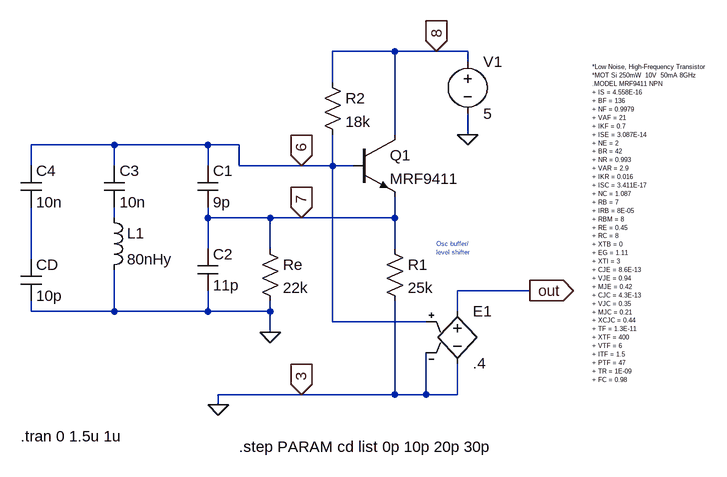
[diagram p0: schematic Collpits_basico.asc]
Collpits_basico.asc, the LTspice schematic file:
Version 4
SHEET 1 1440 1008
WIRE 944 144 848 144
WIRE 1008 144 944 144
WIRE 1056 144 1008 144
WIRE 1056 160 1056 144
WIRE 848 192 848 144
WIRE 944 272 944 144
WIRE 1056 272 1056 240
WIRE 512 288 384 288
WIRE 656 288 512 288
WIRE 704 288 656 288
WIRE 384 320 384 288
WIRE 512 320 512 288
WIRE 656 320 656 288
WIRE 704 320 704 288
WIRE 800 320 704 320
WIRE 848 320 848 272
WIRE 848 320 800 320
WIRE 880 320 848 320
WIRE 512 400 512 384
WIRE 656 400 656 384
WIRE 752 400 656 400
WIRE 800 400 752 400
WIRE 944 400 944 368
WIRE 944 400 800 400
WIRE 656 448 656 400
WIRE 752 448 752 400
WIRE 944 448 944 400
WIRE 384 464 384 384
WIRE 1152 512 1040 512
WIRE 384 544 384 528
WIRE 512 544 512 480
WIRE 512 544 384 544
WIRE 656 544 656 512
WIRE 656 544 512 544
WIRE 752 544 752 528
WIRE 752 544 656 544
WIRE 1040 544 1040 512
WIRE 848 560 848 320
WIRE 992 560 848 560
WIRE 752 576 752 544
WIRE 800 672 672 672
WIRE 944 672 944 528
WIRE 944 672 800 672
WIRE 992 672 992 608
WIRE 992 672 944 672
WIRE 1040 672 1040 624
WIRE 1040 672 992 672
WIRE 672 688 672 672
FLAG 800 320 6
IOPIN 800 320 In
FLAG 800 400 7
IOPIN 800 400 In
FLAG 1056 272 0
FLAG 752 576 0
FLAG 1152 512 out
IOPIN 1152 512 Out
FLAG 800 672 3
IOPIN 800 672 In
FLAG 672 688 0
FLAG 1008 144 8
IOPIN 1008 144 In
SYMBOL cap 640 320 R0
SYMATTR InstName C1
SYMATTR Value 9p
SYMBOL cap 640 448 R0
SYMATTR InstName C2
SYMATTR Value 11p
SYMBOL ind 496 384 R0
SYMATTR InstName L1
SYMATTR Value 80nHy
SYMBOL cap 496 320 R0
SYMATTR InstName C3
SYMATTR Value 10n
SYMBOL cap 368 320 R0
SYMATTR InstName C4
SYMATTR Value 10n
SYMBOL res 928 432 R0
SYMATTR InstName R1
SYMATTR Value 25k
SYMBOL res 832 176 R0
SYMATTR InstName R2
SYMATTR Value 18k
SYMBOL e 1040 528 R0
SYMATTR InstName E1
SYMATTR Value .4
SYMBOL npn 880 272 R0
SYMATTR InstName Q1
SYMATTR Value MRF9411
SYMBOL voltage 1056 144 R0
SYMATTR InstName V1
SYMATTR Value 5
SYMBOL res 736 432 R0
SYMATTR InstName Re
SYMATTR Value 22k
SYMBOL cap 368 464 R0
SYMATTR InstName CD
SYMATTR Value 10p
TEXT 1008 440 Left 0 ;Osc buffer/\nlevel shifter
TEXT 1248 168 Left 0 !*Low Noise, High-Frequency Transistor\n*MOT Si 250mW  10V  50mA 8GHz \n.MODEL MRF9411 NPN \n+ IS = 4.558E-16 \n+ BF = 136 \n+ NF = 0.9979 \n+ VAF = 21 \n+ IKF = 0.7 \n+ ISE = 3.087E-14 \n+ NE = 2 \n+ BR = 42 \n+ NR = 0.993 \n+ VAR = 2.9 \n+ IKR = 0.016 \n+ ISC = 3.411E-17 \n+ NC = 1.087 \n+ RB = 7 \n+ IRB = 8E-05 \n+ RBM = 8 \n+ RE = 0.45 \n+ RC = 8 \n+ XTB = 0 \n+ EG = 1.11 \n+ XTI = 3 \n+ CJE = 8.6E-13 \n+ VJE = 0.94 \n+ MJE = 0.42 \n+ CJC = 4.3E-13 \n+ VJC = 0.35 \n+ MJC = 0.21 \n+ XCJC = 0.44 \n+ TF = 1.3E-11 \n+ XTF = 400 \n+ VTF = 6 \n+ ITF = 1.5 \n+ PTF = 47 \n+ TR = 1E-09 \n+ FC = 0.98
TEXT 368 736 Left 2 !.tran 0 1.5u 1u
TEXT 704 752 Left 2 !.step PARAM cd list 0p 10p 20p 30p

The netlist it stands for:
* Collpits_basico.asc
C1 6 7 9p
C2 7 0 11p
L1 N001 0 80nHy
C3 6 N001 10n
C4 6 N002 10n
R1 7 0 25k
R2 8 6 18k
E1 out 0 6 0 .4
Q1 8 6 7 0 MRF9411
V1 8 0 5
Re 7 0 22k
CD N002 0 10p
.model NPN NPN
.model PNP PNP
.lib standard.bjt
* Osc buffer/
* level shifter
*Low Noise, High-Frequency Transistor
*MOT Si 250mW  10V  50mA 8GHz
.MODEL MRF9411 NPN
+ IS = 4.558E-16
+ BF = 136
+ NF = 0.9979
+ VAF = 21
+ IKF = 0.7
+ ISE = 3.087E-14
+ NE = 2
+ BR = 42
+ NR = 0.993
+ VAR = 2.9
+ IKR = 0.016
+ ISC = 3.411E-17
+ NC = 1.087
+ RB = 7
+ IRB = 8E-05
+ RBM = 8
+ RE = 0.45
+ RC = 8
+ XTB = 0
+ EG = 1.11
+ XTI = 3
+ CJE = 8.6E-13
+ VJE = 0.94
+ MJE = 0.42
+ CJC = 4.3E-13
+ VJC = 0.35
+ MJC = 0.21
+ XCJC = 0.44
+ TF = 1.3E-11
+ XTF = 400
+ VTF = 6
+ ITF = 1.5
+ PTF = 47
+ TR = 1E-09
+ FC = 0.98
.tran 0 1.5u 1u
.step PARAM cd list 0p 10p 20p 30p
.backanno
.end